# EAGLE design p0-001 (EAGLE 9.6.2)
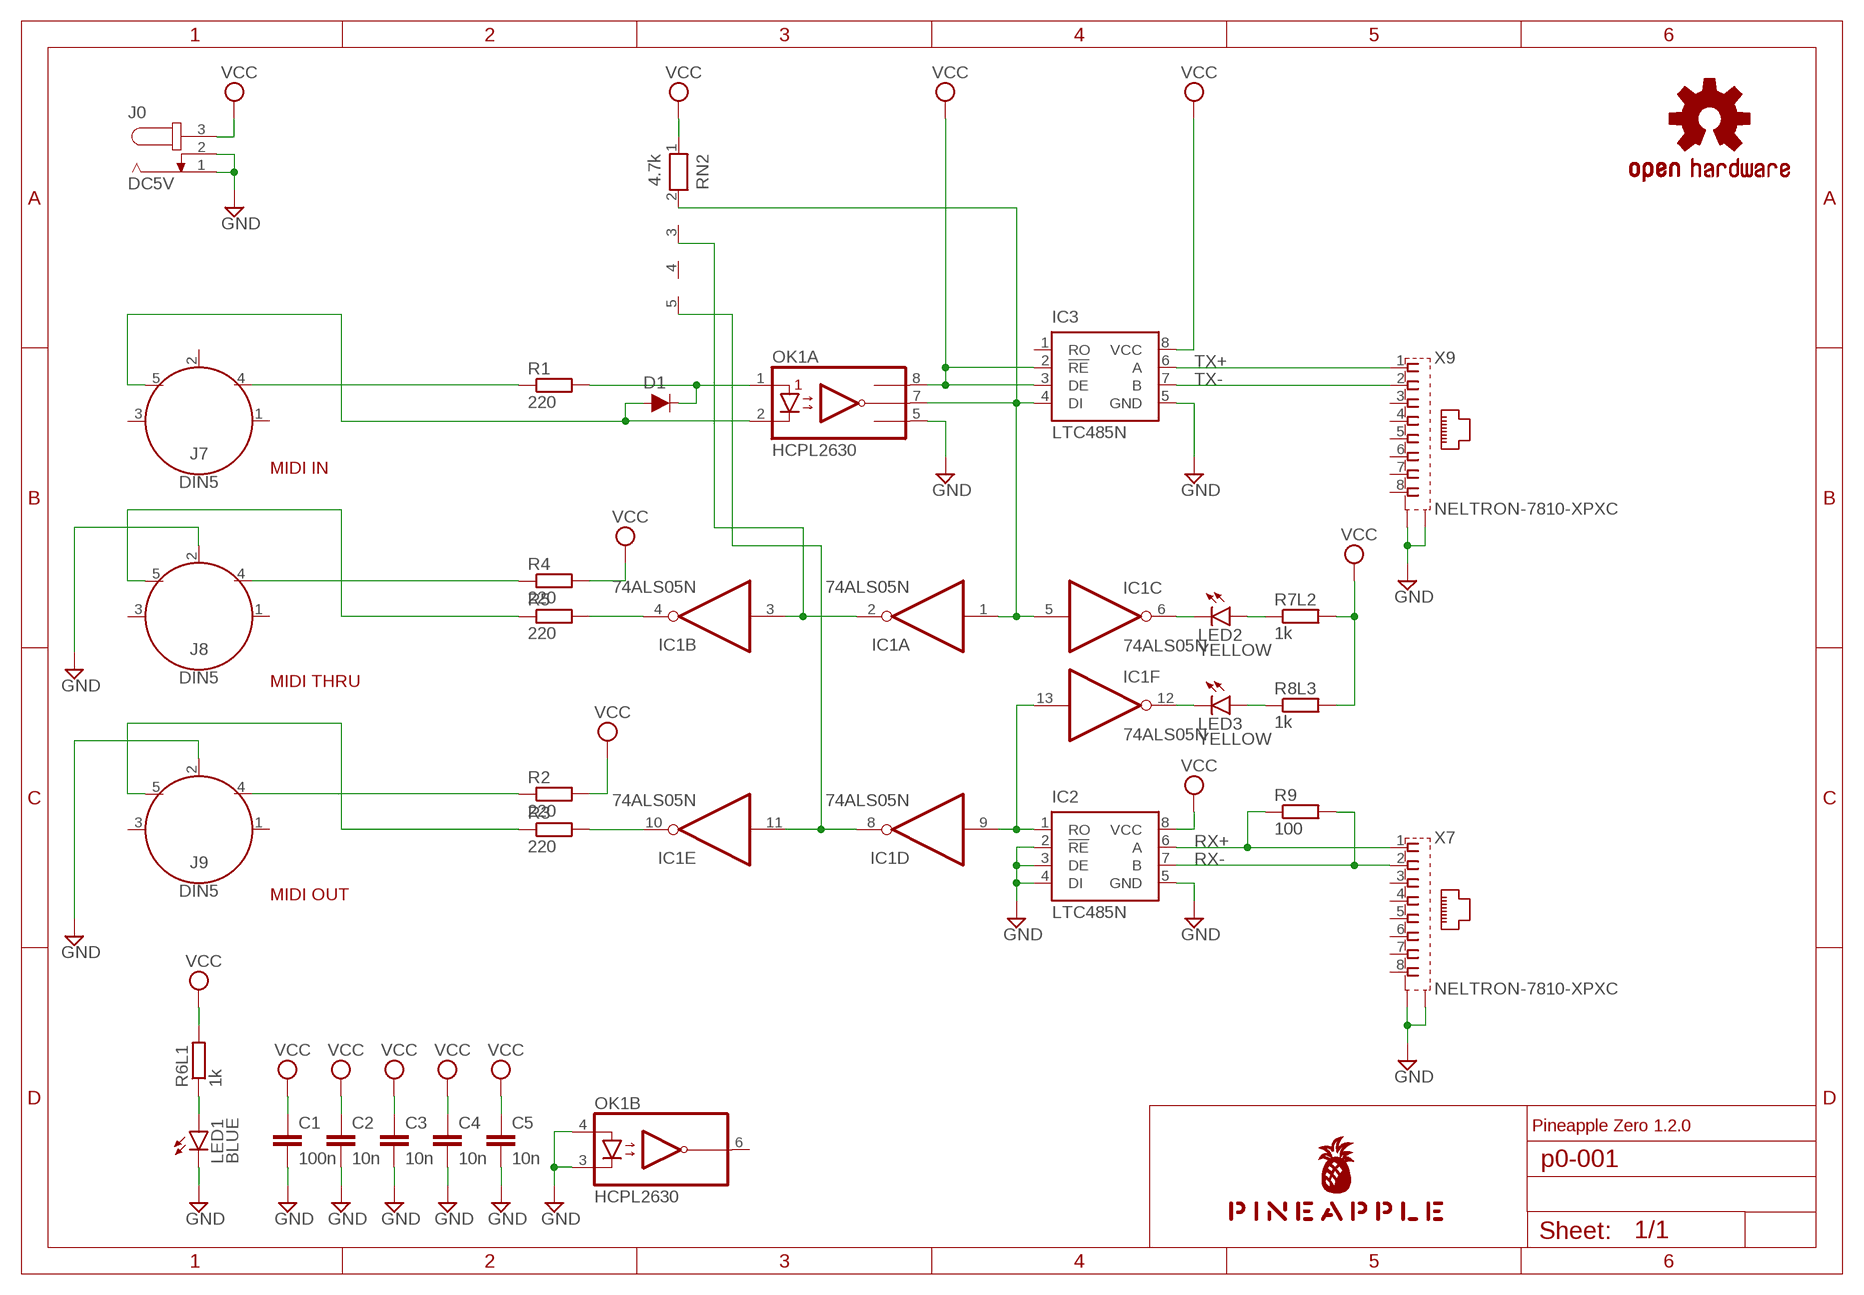
[diagram p0: schematic, sheet 1]

## Parts
C1  100n  C-EU025-024X044  [C025-024X044]
C2  10n  C-EU025-024X044  [C025-024X044]
C3  10n  C-EU025-024X044  [C025-024X044]
C4  10n  C-EU025-024X044  [C025-024X044]
C5  10n  C-EU025-024X044  [C025-024X044]
D1  DIODE-1N4148  [DIODE-1N4148]
IC1  74ALS05N  [DIL14]
IC2  LTC485N  [DIL08]
IC3  LTC485N  [DIL08]
J0  DC5V  JACK-PLUG0  [SPC4077]
J7  DIN5  [DIN5-RA-PTH]
J8  DIN5  [DIN5-RA-PTH]
J9  DIN5  [DIN5-RA-PTH]
LED1  BLUE  LED3MM  [LED3MM]
LED2  YELLOW  LED3MM  [LED3MM]
LED3  YELLOW  LED3MM  [LED3MM]
LOGO1  OSHW-LOGOS-COPPER  [OSHW-LOGO-S_COPPER]
OK1  HCPL2630  [DIL08]
R1  220  R-EU_0204/5  [0204/5]
R2  220  R-EU_0204/5  [0204/5]
R3  220  R-EU_0204/5  [0204/5]
R4  220  R-EU_0204/5  [0204/5]
R5  220  R-EU_0204/5  [0204/5]
R6L1  1k  R-EU_0204/5  [0204/5]
R7L2  1k  R-EU_0204/5  [0204/5]
R8L3  1k  R-EU_0204/5  [0204/5]
R9  100  R-EU_0204/5  [0204/5]
RN2  4.7k  RN04  [RN-5]
U$1  PINEAPPLE450  [PINEAPPLE450]
X7  NELTRON-7810-XPXC  [NELTRON-7810-XPXC-FOOTPRINT]
X9  NELTRON-7810-XPXC  [NELTRON-7810-XPXC-FOOTPRINT]

## Nets
GND [gnd]: C1.2 C2.2 C3.2 C4.2 C5.2 IC2.2(!RE) IC2.3(DE) IC2.4(DI) IC2.5(GND) IC3.5(GND) J0.1 J0.2 J8.2 J9.2 LED1.K(C) OK1.3(B:C2) OK1.4(B:A2) OK1.5(A:GND) X7.S1 X7.S2 X9.S1 X9.S2
MIDIIN: D1.C OK1.1(A:A1) R1.2
MIDIOUT: IC1.10(E:O) R3.2
MIDITHRU: IC1.4(B:O) R5.2
MIRTN: D1.A J7.5 OK1.2(A:C1)
MISND: J7.4 R1.1
MORTN: J9.5 R3.1
MOSND: J9.4 R2.1
MTRTN: J8.5 R5.1
MTSND: J8.4 R4.1
N$1: IC1.6(C:O) LED2.K(C)
N$2: LED3.A R8L3.1
N$3: IC1.12(F:O) LED3.K(C)
N$4: LED1.A R6L1.1
N$5: LED2.A R7L2.1
NMIDIOUT: IC1.8(D:O) IC1.11(E:I) RN2.5
NMIDITHRU: IC1.2(A:O) IC1.3(B:I) RN2.3
RX: IC1.9(D:I) IC1.13(F:I) IC2.1(RO)
RX+: IC2.6(A) R9.1 X7.1
RX-: IC2.7(B) R9.2 X7.2
TX: IC1.1(A:I) IC1.5(C:I) IC3.4(DI) OK1.7(A:VO1) RN2.2
TX+: IC3.6(A) X9.1
TX-: IC3.7(B) X9.2
VCC [pwr]: C1.1 C2.1 C3.1 C4.1 C5.1 IC2.8(VCC) IC3.2(!RE) IC3.3(DE) IC3.8(VCC) J0.3 OK1.8(A:VCC) R2.2 R4.2 R6L1.2 R7L2.2 R8L3.2 RN2.1
Unconnected: IC3.1(RO) J7.1 J7.2 J7.3 J8.1 J8.3 J9.1 J9.3 OK1.6(B:VO2) RN2.4 X7.3 X7.4 X7.5 X7.6 X7.7 X7.8 X9.3 X9.4 X9.5 X9.6 X9.7 X9.8

## Notes on the sheet
- MIDI IN
- MIDI THRU
- MIDI OUT
- Pineapple Zero 1.2.0

## Power pins joined to a net without a drawn wire
GND: IC1.7(P:GND)
VCC: IC1.14(P:VCC)

## Library data of the parts
C1-C5 = rcl:C-EU: CAPACITOR, European symbol; SPICEPREFIX: C
D1 = SparkFun-DiscreteSemi:DIODE: Diode These are standard reverse protection diodes and small signal diodes. SparkFun Products: SparkFun SparkPunk Sound Kit <https://www.sparkfun.com/products/11177> SparkFun ESP8266 Thing <https://www.sparkfun.com/products/13231>; PROD_ID: DIO-08378; VALUE: 200mA/100V/1V
IC1 = 74xx-us:74*05: Hex INVERTER, open collector
IC2 IC3 = linear-technology:LTC485: Low Power RS485 Interface Transceiver Source: http://www.linear.com/pc/downloadDocument.do?navId=H0,C1,C1007,C1017,P2064,D1718; OC_FARNELL: unknown; OC_NEWARK: unknown
J0 = con-jack:JACK-PLUG: DC POWER JACK Power Jack, DC, Right Angle, Through Hole, Rated 5A at 16VDC, PC Terminals Distributor: Farnell (www.Farnell.de) Drawing: 84N1161.pdf / 84N1162.pdf Manufacturer: SPC Technology (www.spctechnology.com) Type: SPC4077 / SPC 4078; OC_FARNELL: unknown; OC_NEWARK: unknown
J7-J9 = SparkFun-Connectors:DIN5: DIN5 Connector - Female Right Angle (frequently used as a MIDI Jack connector) This type of connector and cable is frequently used for transmitting midi data (musical instrument digital interface). It is what you usually see on a keyboard or set of electronic drums. Learn more here <https://en.wikipedia.org/wiki/MIDI>. For more information on the pinout and electrical specifications of MIDI communications, please see the following resource: https://www.midi.org/specifications/item/midi-din-electrical-specification Here is the connector we sell at SparkFun: MIDI Connector - Female Right Angle <https://www.sparkfun.com/products/9536> (PRT-09536) Datasheet <hhttp://www.sparkfun.com/datasheets/Prototyping/Connectors/MIDI-RA.pdf> It is used on this SparkFun product: SparkFun MIDI Shield <https://www.sparkfun.com/products/12898> (DEV-12898); PROD_ID: CONN-09481
LED1-LED3 = led:LED: LED OSRAM: - CHIPLED LG R971, LG N971, LY N971, LG Q971, LY Q971, LO R971, LY R971 LH N974, LH R974 LS Q976, LO Q976, LY Q976 LO Q996 - Hyper CHIPLED LW Q18S LB Q993, LB Q99A, LB R99A - SideLED LS A670, LO A670, LY A670, LG A670, LP A670 LB A673, LV A673, LT A673, LW A673 LH A674 LY A675 LS A676, LA A676, LO A676, LY A676, LW A676 LS A679, LY A679, LG A679 - Hyper Micro SIDELED® LS Y876, LA Y876, LO Y876, LY Y876 LT Y87S - SmartLED LW L88C, LW L88S LB L89C, LB L89S, LG L890 LS L89K, LO L89K, LY L89K LS L896, LA L896, LO L896, LY L896 - TOPLED LS T670, LO T670, LY T670, LG T670, LP T670 LSG T670, LSP T670, LSY T670, LOP T670, LYG T670 LG T671, LOG T671, LSG T671 LB T673, LV T673, LT T673, LW T673 LH T674 LS T676, LA T676, LO T676, LY T676, LB T676, LH T676, LSB T676, LW T676 LB T67C, LV T67C, LT T67C, LS T67K, LO T67K, LY T67K, LW E67C LS E67B, LA E67B, LO E67B, LY E67B, LB E67C, LV E67C, LT E67C LW T67C LS T679, LY T679, LG T679 LS T770, LO T770, LY T770, LG T770, LP T770 LB T773, LV T773, LT T773, LW T773 LH T774 LS E675, LA E675, LY E675, LS T675 LS T776, LA T776, LO T776, LY T776, LB T776 LHGB T686 LT T68C, LB T68C - Hyper Mini TOPLED® LB M676 - Mini TOPLED Santana® LG M470 LS M47K, LO M47K, LY M47K Source: http://www.osram.convergy.de LUXEON: - LUMILED® LXK2-PW12-R00, LXK2-PW12-S00, LXK2-PW14-U00, LXK2-PW14-V00 LXK2-PM12-R00, LXK2-PM12-S00, LXK2-PM14-U00 LXK2-PE12-Q00, LXK2-PE12-R00, LXK2-PE12-S00, LXK2-PE14-T00, LXK2-PE14-U00 LXK2-PB12-K00, LXK2-PB12-L00, LXK2-PB12-M00, LXK2-PB14-N00, LXK2-PB14-P00, LXK2-PB14-Q00 LXK2-PR12-L00, LXK2-PR12-M00, LXK2-PR14-Q00, LXK2-PR14-R00 LXK2-PD12-Q00, LXK2-PD12-R00, LXK2-PD12-S00 LXK2-PH12-R00, LXK2-PH12-S00 LXK2-PL12-P00, LXK2-PL12-Q00, LXK2-PL12-R00 Source: www.luxeon.com KINGBRIGHT: KA-3528ASYC Source: www.kingbright.com
LOGO1 = SparkFun-Aesthetics:OSHW-LOGO: Open-Source Hardware (OSHW) Logo This logo indicates the piece of hardware it is found on incorporates a OSHW license and/or adheres to the definition of open source hardware found here: http://freedomdefined.org/OSHW
OK1 = optocoupler:HCPL2630: HEWLETT PACKARD OPTO COUPLER; MF: AGILENT TECHNOLOGIES; MPN: HCPL-2630-000E; OC_FARNELL: 9994904; OC_NEWARK: 88H7813
R1-R5 R6L1 R7L2 R8L3 R9 = rcl:R-EU_: RESISTOR, European symbol; SPICEPREFIX: R
RN2 = resistor-net:RN04: RESISTOR NETWORK; OC_FARNELL: unknown; OC_NEWARK: unknown
U$1 = pineapple:PINEAPPLE450
X7 X9 = con-rj45:NELTRON-7810-XPXC: Mod. Jack, Right Angle, 8 posiotion, 8 contatcs RJ45 Source: GLX-S-88M.pdf

## Net classes
0 default: width 0.152 mm, drill 0.152 mm, clearance 0.152 mm
1 pwr: width 0.305 mm, drill 0.152 mm, clearance 0.152 mm
2 gnd: width 0.305 mm, drill 0.152 mm, clearance 0.152 mm

## Board
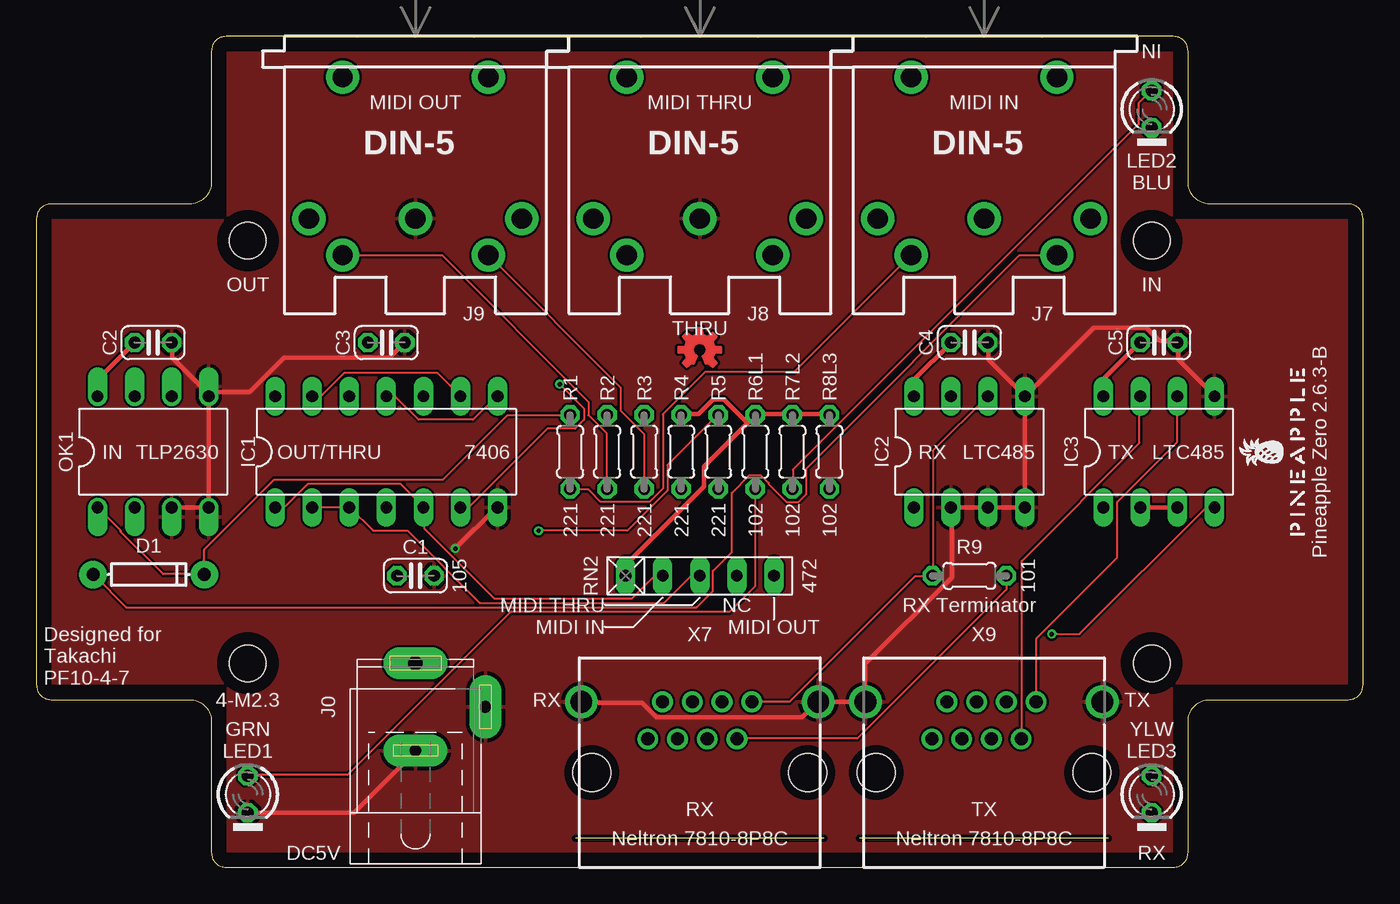
[diagram p1: board, top side]
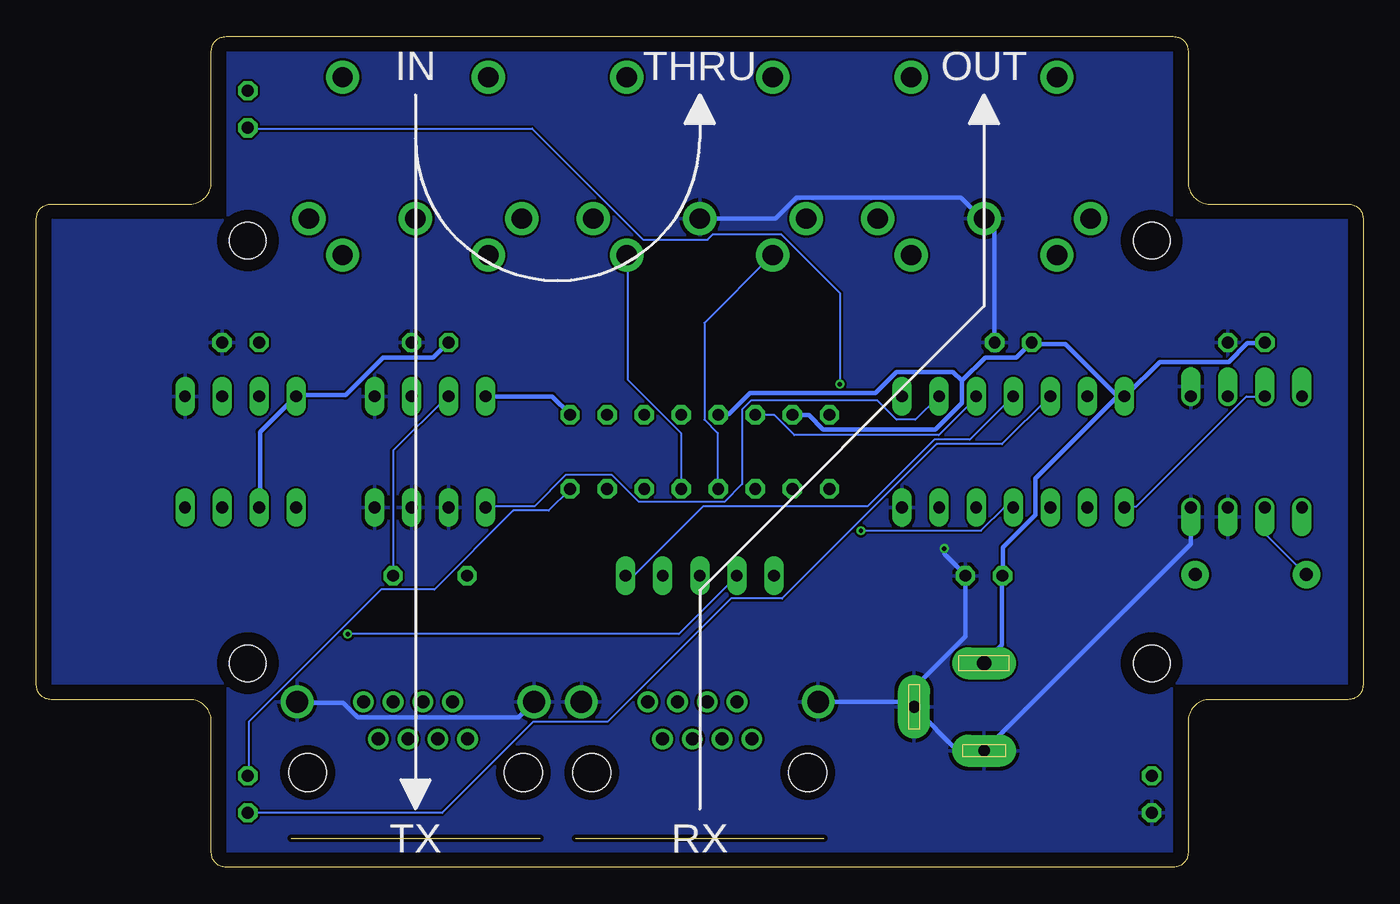
[diagram p2: board, bottom side, seen from below]

Size 91 x 57 mm. Coordinates in mm from the lower left corner, seen from the top.
Outline: 1,11.5 10.5,11.5 arc-90 12,10 12,1 arc90 13,0 78,0 arc90 79,1 79,10 arc-90 80.5,11.5 90,11.5 arc90 91,12.5 91,44.5 arc90 90,45.5 80.5,45.5 arc-90 79,47 79,56 arc90 78,57 13,57 arc90 12,56 12,47 arc-90 10.5,45.5 1,45.5 arc90 0,44.5 0,12.5 arc90 1,11.5
Copper layers (1*16): Top 0.035mm / dielectric 1.5mm / Bottom 0.035mm
Design rules "SeeedStudio_2layer_DRU_no_angle_20140221": minimum track width 6mil, minimum drill 12mil, track to track 6mil, track to pad 6mil, pad to pad 6mil, via to via 6mil, smd to smd 0mil, copper to edge 10mil, drill to drill 10mil, minimum pad ring 10mil, minimum via ring 6mil, stop-mask expansion 2mil, vias tented up to drill 100mil, thermal gap 10mil
Holes 2.5 mm at 14.5,14 76.5,14 76.5,43 14.5,43
tRestrict: area 0,11.5 to 1,45.5; area 0,44.5 to 13,45.5; area 12,44.5 to 13,57; area 12,56 to 79,57; area 78,44.5 to 79,57; area 78,44.5 to 91,45.5; area 90,11.5 to 91,45.5; area 78,11.5 to 91,12.5; area 78,0 to 79,12.5; area 12,0 to 79,1; area 12,0 to 13,12.5; area 0,11.5 to 13,12.5; 4 more areas
bRestrict: area 12,56 to 79,57; area 90,11.5 to 91,45.5; area 12,0 to 79,1; area 0,11.5 to 1,45.5; area 12.5,12 to 16.5,16; area 12,44.5 to 13,57; area 78,44.5 to 79,57; area 12,0 to 13,12.5; area 78,0 to 79,12.5; area 0,44.5 to 13,45.5; area 0,11.5 to 13,12.5; area 78,11.5 to 91,12.5; 4 more areas

### Footprints (pad centres in the part's own frame; a part is rotated, then mirrored left to right if it is on the bottom)
C025-024X044 = drill 0.813 octagon: 1 -1.27,0; 2 1.27,0
DIODE-1N4148 = drill 0.9 pad 1.88: A -3.81,0; C 3.81,0
DIL14 = drill 0.813 long: 1 -7.62,-3.81; 2 -5.08,-3.81; 3 -2.54,-3.81; 4 0,-3.81; 5 2.54,-3.81; 6 5.08,-3.81; 7 7.62,-3.81; 8 7.62,3.81; 9 5.08,3.81; 10 2.54,3.81; 11 0,3.81; 12 -2.54,3.81; 13 -5.08,3.81; 14 -7.62,3.81
DIL08 = drill 0.813 long: 1 -3.81,-3.81; 2 -1.27,-3.81; 3 1.27,-3.81; 4 3.81,-3.81; 5 3.81,3.81; 6 1.27,3.81; 7 -1.27,3.81; 8 -3.81,3.81
SPC4077 = drill 0.8 pad 2.184 long: 1 -3,0; 2 0,-4.8 | drill 1 pad 2.184 long: 3 3,0
DIN5-RA-PTH = drill 1.4 pad 2.286: 1 7.3,12.5; 2 0,12.5; 3 -7.3,12.5; 4 5,15; 5 -5,15; 6 -5,2.8; 7 5,2.8
LED3MM = drill 0.813 octagon: A -1.27,0; K 1.27,0
DIL08' = drill 0.813 offset: 1 -3.81,-3.81; 2 -1.27,-3.81; 3 1.27,-3.81; 4 3.81,-3.81; 5 3.81,3.81; 6 1.27,3.81; 7 -1.27,3.81; 8 -3.81,3.81
0204/5 = drill 0.813 octagon: 1 -2.54,0; 2 2.54,0
RN-5 = drill 0.813 long: 1 -5.08,0; 2 -2.54,0; 3 0,0; 4 2.54,0; 5 5.08,0
NELTRON-7810-XPXC-FOOTPRINT = drill 0.9 pad 1.422: 1 -3.57,-4.84; 2 -2.55,-2.3; 3 -1.53,-4.84; 4 -0.51,-2.3; 5 0.51,-4.84; 6 1.53,-2.3; 7 2.55,-4.84; 8 3.57,-2.3 | drill 1.5 pad 2.184: S1 -8.125,-4.84; S2 8.125,-4.84 | hole 2.6: -7.4,0; 7.4,0

### Placement (x,y rotation side)
C1  26,20 0 top
C2  8,36 0 top
C3  24,36 0 top
C4  64,36 0 top
C5  77,36 0 top
D1  7.7,20.08 0 top
IC1  24,28.5 0 top
IC2  64,28.5 0 top
IC3  77,28.5 0 top
J0  26,11 90 top
J7  65,57 180 top
J8  45.5,57 180 top
J9  26,57 180 top
LED1  14.5,5 270 top
LED2  76.5,52 270 top
LED3  76.5,5 270 top
LOGO1  45.5,35.5 0 top
OK1  HCPL2630  [DIL08']  8,28.5 0 top
R1  36.61,28.5 90 top
R2  39.15,28.5 90 top
R3  41.69,28.5 90 top
R4  44.23,28.5 90 top
R5  46.77,28.5 90 top
R6L1  49.31,28.5 90 top
R7L2  51.85,28.5 90 top
R8L3  54.39,28.5 90 top
R9  64,20 0 top
RN2  45.5,20 0 top
U$1  87,28.5 90 top
X7  45.5,6.5 180 top
X9  65,6.5 180 top

### Tracks (layer width: path | path; a pad name or v marks a point on that pad's centre or on a via)
GND  (via drill 0.3)
  Top 0.305: OK1.3 9.3,24.69 11.73,24.69 OK1.4 11.81,24.84 11.81,32.23 OK1.5 | C2.2 9.3,35.97 9.3,34.98 11.73,32.54 11.73,32.38 OK1.5 | OK1.5 11.81,32.61 14.63,32.61 16.99,34.98 24.23,34.98 25.22,35.97 C3.2 | LED1.K 14.55,3.73 21.79,3.73 25.98,7.92 J0.1 | v28.73,21.87 31.55,24.69 IC1.7 | IC3.5 80.77,32.38 78.33,34.82 78.33,35.97 C5.2 78.18,36.12 77.04,36.12 76.12,37.03 72.54,37.03 67.89,32.38 IC2.5 | C4.2 65.3,35.97 65.3,34.82 67.74,32.38 IC2.5 | IC2.5 67.82,32.23 67.82,24.84 IC2.4 67.74,24.69 65.38,24.69 IC2.3 65.23,24.69 62.79,24.69 IC2.2 62.79,24.54 62.79,19.89 56.84,13.95 56.84,11.51 X9.S2 56.84,11.35 53.65,11.35 X7.S1 53.49,11.28 52.5,10.29 42.52,10.29 41.53,11.28 37.41,11.28 X7.S2
  Bottom 0.305: C3.2 25.3,36.04 25.3,43.74 25.98,44.42 J9.2 26.14,44.5 27.58,45.95 38.86,45.95 40.31,44.5 J8.2 | J0.2 30.79,11.05 30.79,12.34 27.28,15.85 27.28,19.96 C1.2 27.36,20.12 28.73,21.49 v28.73,21.87 | X7.S2 37.34,11.35 30.86,11.35 J0.2 | J0.2 30.71,10.9 27.81,8 26.06,8 J0.1 25.91,8.08 11.81,22.17 OK1.4 | X9.S1 73.08,11.28 69.95,11.28 68.96,10.29 57.91,10.29 56.92,11.28 X9.S2
  pour Top: -1,-1 92,-1 92,58 -1,58
  pour Bottom: -2,-2 93,-2 93,59 -2,59
MIDIIN
  Top 0.152: OK1.1 5.79,23.09 5.79,23.01 8.69,20.12 11.51,20.12 D1.C 11.51,20.19 11.51,21.79 16.31,26.59 27.89,26.59 32.31,31.01 36.58,31.01 R1.2
MIDIOUT
  Bottom 0.152: R3.2 41.68,31.01 40.39,31.01 39.01,29.64 29.11,29.64 26.59,32.16 26.59,32.31 IC1.10
MIDITHRU  (via drill 0.3)
  Top 0.152: v34.44,23.09 40.54,23.09 43.28,25.83 43.28,27.58 46.71,31.01 R5.2
  Bottom 0.152: v34.44,23.09 26.21,23.09 24.61,24.69 IC1.4
MIRTN
  Top 0.152: J7.5 69.95,41.99 67.44,41.99 52.81,27.36 52.81,25.6 52.27,25.07 51.44,25.07 50.22,26.29 50.22,26.36 49.68,26.9 48.92,26.9 47.7,25.68 47.7,21.64 46.41,20.34 46.41,18.97 45.26,17.83 6.17,17.83 3.96,20.04 D1.A
  Bottom 0.152: OK1.2 6.71,24.69 6.71,22.86 3.96,20.12 D1.A
MISND
  Top 0.152: R1.1 36.65,25.91 37.87,25.91 38.71,25.07 42.06,25.07 42.98,25.98 42.98,31.09 45.87,33.98 51.97,33.98 59.97,41.99 J7.4
MORTN
  Top 0.152: R3.1 41.68,25.98 41.68,29.72 40.08,31.32 40.08,32.92 31.01,41.99 J9.5
MOSND
  Top 0.152: R2.1 39.09,25.98 39.09,29.79 37.87,31.01 37.87,31.93 27.81,41.99 21.03,41.99 J9.4
MTRTN
  Bottom 0.152: R5.1 46.79,25.98 46.79,29.79 50.44,33.45 50.44,41.99 J8.5
MTSND
  Bottom 0.152: R4.1 44.27,25.98 44.27,29.79 45.19,30.71 45.19,37.34 40.54,41.99 J8.4
N$1  (via drill 0.3)
  Top 0.152: v35.89,33.15 37.57,31.47 37.57,30.71 36.96,30.1 35.05,30.1 29.72,24.77 29.11,24.77 IC1.6
  Bottom 0.152: v35.89,33.15 35.89,39.4 39.93,43.43 44.58,43.43 44.96,43.05 49.38,43.05 57,50.67 76.43,50.67 LED2.K
N$2
  Bottom 0.152: LED3.A 76.43,6.33 76.43,9.98 67.36,19.05 63.7,19.05 58.29,24.46 55.85,24.46 54.41,25.91 R8L3.1
N$3
  Bottom 0.152: LED3.K 76.43,3.73 63.17,3.73 56.92,9.98 51.82,9.98 43.36,18.44 39.85,18.44 29.26,29.03 24.77,29.03 21.49,32.31 IC1.12
N$4
  Top 0.152: LED1.A 14.55,6.33 21.34,6.33 32.54,17.53 47.55,17.53 49.3,19.28 49.3,25.91 R6L1.1
N$5
  Top 0.152: R7L2.1 51.89,25.98 51.89,27.28 75.59,50.98 75.59,52.43 76.43,53.26 LED2.A
NMIDIOUT
  Top 0.152: IC1.11 24.61,32.31 26.21,30.71 29.95,30.71 31.55,32.31 IC1.8
  Bottom 0.152: RN2.5 50.52,20.04 49.99,20.04 45.26,24.77 33.98,24.77 29.41,29.34 26.98,29.34 IC1.11
NMIDITHRU
  Top 0.152: IC1.2 18.97,24.69 21.41,24.69 IC1.3 21.49,24.69 23.09,23.09 25.45,23.09 30.4,18.14 43.05,18.14 44.88,19.96 45.49,19.96 RN2.3
RX
  Top 0.152: IC1.13 18.97,32.38 19.58,32.38 21.11,33.91 27.51,33.91 29.03,32.38 IC1.9
  Bottom 0.152: IC2.1 60.12,24.77 56.84,24.77 54.71,26.9 51.51,26.9 49.68,25.07 43.81,25.07 42.6,26.29 42.6,31.39 41.99,32 33.3,32 32,30.71 30.71,30.71 29.11,32.31 IC1.9
RX+
  Top 0.152: IC2.6 65.23,32.31 61.49,28.57 61.49,20.04 R9.1 61.42,19.96 60.27,19.96 51.66,11.35 49.07,11.35 X7.1
RX-
  Top 0.152: X7.2 48.08,8.84 56.31,8.84 66.52,19.05 66.52,19.96 R9.2
  Bottom 0.152: R9.2 66.52,20.04 66.52,28.57 62.79,32.31 IC2.7
TX  (via drill 0.3)
  Top 0.152: IC1.1 16.38,24.77 17.07,24.77 18.59,26.29 24.99,26.29 26.52,24.77 IC1.5 26.59,24.69 26.59,23.24 31.39,18.44 40.84,18.44 42.37,19.96 42.9,19.96 RN2.2 | v69.65,16 71.55,16 80.24,24.69 80.77,24.69 IC3.4
  Bottom 0.152: v69.65,16 46.94,16 42.98,19.96 RN2.2 | OK1.7 6.78,32.31 8,32.31 15.54,24.77 16.31,24.77 IC1.1
TX+
  Top 0.152: IC3.6 78.26,32.31 78.26,29.18 74.14,25.07 74.14,21.26 68.58,15.7 68.58,11.35 X9.1
TX-
  Top 0.152: IC3.7 75.67,32.31 75.67,29.11 67.59,21.03 67.59,8.84 X9.2
VCC
  Top 0.305: IC3.2 75.74,24.69 78.26,24.69 IC3.3 | IC3.8 73.23,32.38 73.23,33.53 75.67,35.97 C5.1 | IC2.8 60.2,32.38 60.2,33.45 62.71,35.97 C4.1 | 48.77,30.48 49.3,31.01 R6L1.2 49.45,31.09 51.82,31.09 R7L2.2 51.97,31.09 54.33,31.09 R8L3.2 | 48.77,30.48 45.8,27.51 45.8,26.14 40.46,20.8 40.46,20.04 RN2.1 | 48.77,30.48 47.17,32.08 46.41,32.08 45.41,31.09 44.27,31.09 R4.2 | OK1.8 4.19,32.38 4.19,33.45 6.71,35.97 C2.1
  Bottom 0.305: IC3.2 75.67,24.77 75.67,29.87 73.23,32.31 IC3.8 73.08,32.38 69.8,32.38 67.21,34.98 63.78,34.98 62.79,35.97 C4.1 | IC2.8 60.12,32.31 55.63,32.31 54.41,31.09 R8L3.2 | J0.3 25.98,14.02 24.77,15.24 24.77,19.96 C1.1 24.69,20.12 24.69,21.95 22.48,24.16 22.48,26.67 16.84,32.31 IC1.14 | 27.51,33.38 27.51,31.85 29.34,30.02 37.03,30.02 38.02,31.01 39.09,31.01 R2.2 | 27.51,33.38 25.91,34.98 23.77,34.98 22.78,35.97 C3.1 22.63,35.89 20.42,35.89 16.92,32.38 16.38,32.38 IC1.14 | C2.1 6.78,35.97 7.92,35.97 9.22,34.67 13.95,34.67 16.23,32.38 IC1.14 | 27.51,33.38 28.12,33.98 32,33.98 33.45,32.54 42.06,32.54 43.51,31.09 44.2,31.09 R4.2

### Text on the board
tNames: NI | MIDI OUT | MIDI THRU | MIDI IN | BLU | OUT | IN | THRU | IN | TLP2630 | OUT/THRU | 7406 | RX | LTC485 | TX | LTC485 | Pineapple Zero 2.6.3-B | 221 | 221 | 221 | 221 | 221 | 102 | 102 | 102 | 105 | 472 | 101 | MIDI THRU | NC | RX Terminator | MIDI IN | MIDI OUT | Designed for / Takachi / PF10-4-7 | 4-M2.3 | RX | TX | GRN | YLW | RX | TX | Neltron 7810-8P8C | Neltron 7810-8P8C | DC5V | RX
bNames: OUT | THRU | IN | RX | TX